# EAGLE schematic PCB_CoLAB_Schematic (EAGLE 9.6.2)
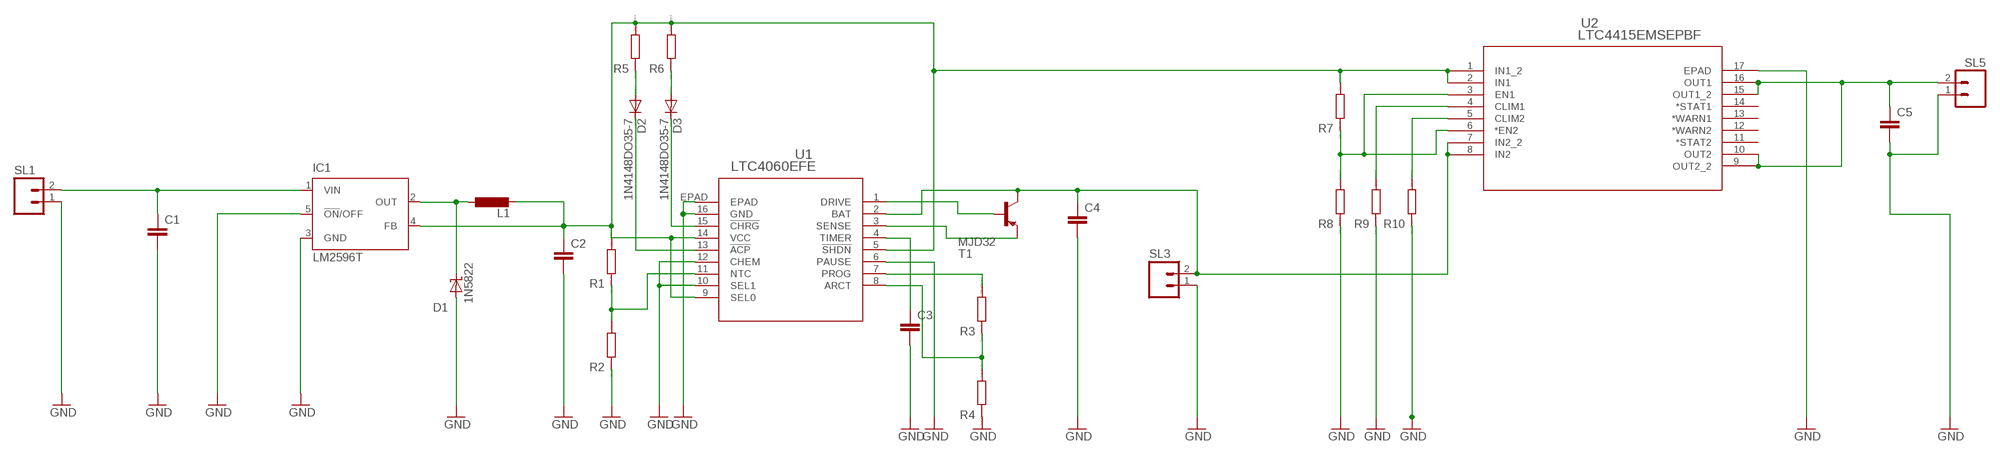
[diagram p0: schematic, sheet 1]

## Parts
C1  C-EU025-024X044  [C025-024X044]
C2  C-EU025-024X044  [C025-024X044]
C3  C-EU025-024X044  [C025-024X044]
C4  C-EU025-024X044  [C025-024X044]
C5  C-EU025-024X044  [C025-024X044]
D1  1N5822  [DIOAD2120W130L950D530P]
D2  1N4148DO35-7  [DO35-7]
D3  1N4148DO35-7  [DO35-7]
IC1  LM2596T  [T05D]
L1  L-EU0204/7  [0204/7]
R1  R0204/7  [0204/7]
R2  R0204/7  [0204/7]
R3  R0204/7  [0204/7]
R4  R0204/7  [0204/7]
R5  R0204/7  [0204/7]
R6  R0204/7  [0204/7]
R7  R0204/7  [0204/7]
R8  R0204/7  [0204/7]
R9  R0204/7  [0204/7]
R10  R0204/7  [0204/7]
SL1  M02  [02P]
SL3  M02  [02P]
SL5  M02  [02P]
T1  MJD32  [DPAK]
U1  LTC4060EFE  [TSSOP-16_FE/BC_LIT]
U2  LTC4415EMSEPBF  [MSOP-16_MSE]

## Nets
GND: C1.2 C2.2 C3.2 C4.2 C5.2 D1.A IC1.3(GND) IC1.5(!ON!/OFF) R2.1 R4.1 R8.1 R9.1 R10.1 SL1.1 SL3.1 SL5.1 U1.6(PAUSE) U1.10(SEL1) U1.12(CHEM) U1.16(GND) U1.EPAD U2.17(EPAD)
N$1: R3.2 U1.7(PROG)
N$2: C1.1 IC1.1(VIN) SL1.2
N$3: D1.C IC1.2(OUT) L1.1
N$4: R1.1 R2.2 U1.11(NTC)
N$5: R7.1 R8.2 U2.3(EN1) U2.6(*EN2)
N$6: R3.1 R4.2 U1.8(ARCT)
N$7: T1.3(E) U1.3(SENSE)
N$8: T1.1(B) U1.1(DRIVE)
N$9: C2.1 IC1.4(FB) L1.2 R1.2 R5.2 R6.2 R7.2 U1.5(!SHDN) U1.9(SEL0) U1.14(VCC) U2.1(IN1_2) U2.2(IN1)
N$11: C3.1 U1.4(TIMER)
N$12: D2.A R5.1
N$13: D2.C U1.13(!ACP)
N$14: D3.C U1.15(!CHRG)
N$15: D3.A R6.1
N$16: C4.1 SL3.2 T1.4(C) U1.2(BAT) U2.7(IN2_2) U2.8(IN2)
N$17: R9.2 U2.4(CLIM1)
N$18: R10.2 U2.5(CLIM2)
N$19: C5.1 SL5.2 U2.9(OUT2_2) U2.10(OUT2) U2.15(OUT1_2) U2.16(OUT1)
Unconnected: U2.11(*STAT2) U2.12(*WARN2) U2.13(*WARN1) U2.14(*STAT1)

## Library data of the parts
C1-C5 = rcl:C-EU: CAPACITOR, European symbol
D1 = 1N5822:1N5822: 1N5822 Series 40 V 3 A Through Hole Schottky Rectifier - DO-201AD Check prices <https://pricing.snapeda.com/parts/1N5822/ON%20Semiconductor/view-part?ref=eda>; AVAILABILITY: Good; DESCRIPTION: Diode Schottky 40V 3A Through Hole DO-201AD; MF: ON Semiconductor; MP: 1N5822; PACKAGE: AXIAL LEAD-2 ON Semiconductor; PRICE: None; PURCHASE-URL: https://pricing.snapeda.com/search/part/1N5822/?ref=eda
D2 D3 = diode:1N4148: DIODE high speed (Philips)
IC1 = national-semiconductor:LM2596: SIMPLE SWITCHER® Power Converter 150 kHz 3A Step-Down Voltage Regulator Source: http://www.national.com/ds/LM/LM2596.pdf; MPN: LM2596T-ADJ/LF02; OC_FARNELL: 9494162; OC_NEWARK: 65K5910
L1 = rcl:L-EU: INDUCTOR, European symbol
R1-R10 = eagle-ltspice:R: RESISTOR, European symbol; SPICEMODEL: NONE; SPICEPREFIX: R
SL1 SL3 SL5 = con-amp-quick:M02: AMP QUICK CONNECTOR; OC_FARNELL: unknown; OC_NEWARK: unknown
T1 = transistor:MJD32*: Complementary Power Transistors
U1 = LTC4060:LTC4060EFE; BUILT_BY: EMA_UL_Team; MANUFACTURER_PART_NUMBER: LTC4060EFE; SOURCELIBRARY: LinearTech_2016-05-13_9; VENDOR: Linear Technology
U2 = LTC4415EMSEPBF:LTC4415EMSEPBF: Check prices <https://pricing.snapeda.com/parts/LTC4415EMSE%23PBF/Analog%20Devices/view-part?ref=eda>; AVAILABILITY: Warning; DESCRIPTION: OR Controller Source Selector Switch P-Channel 2:2 16-MSOP-EP; MF: Analog Devices; MP: LTC4415EMSE#PBF; PACKAGE: MSOP -16 Analog Devices; PRICE: None; PURCHASE-URL: https://pricing.snapeda.com/search/part/LTC4415EMSE#PBF/?ref=eda